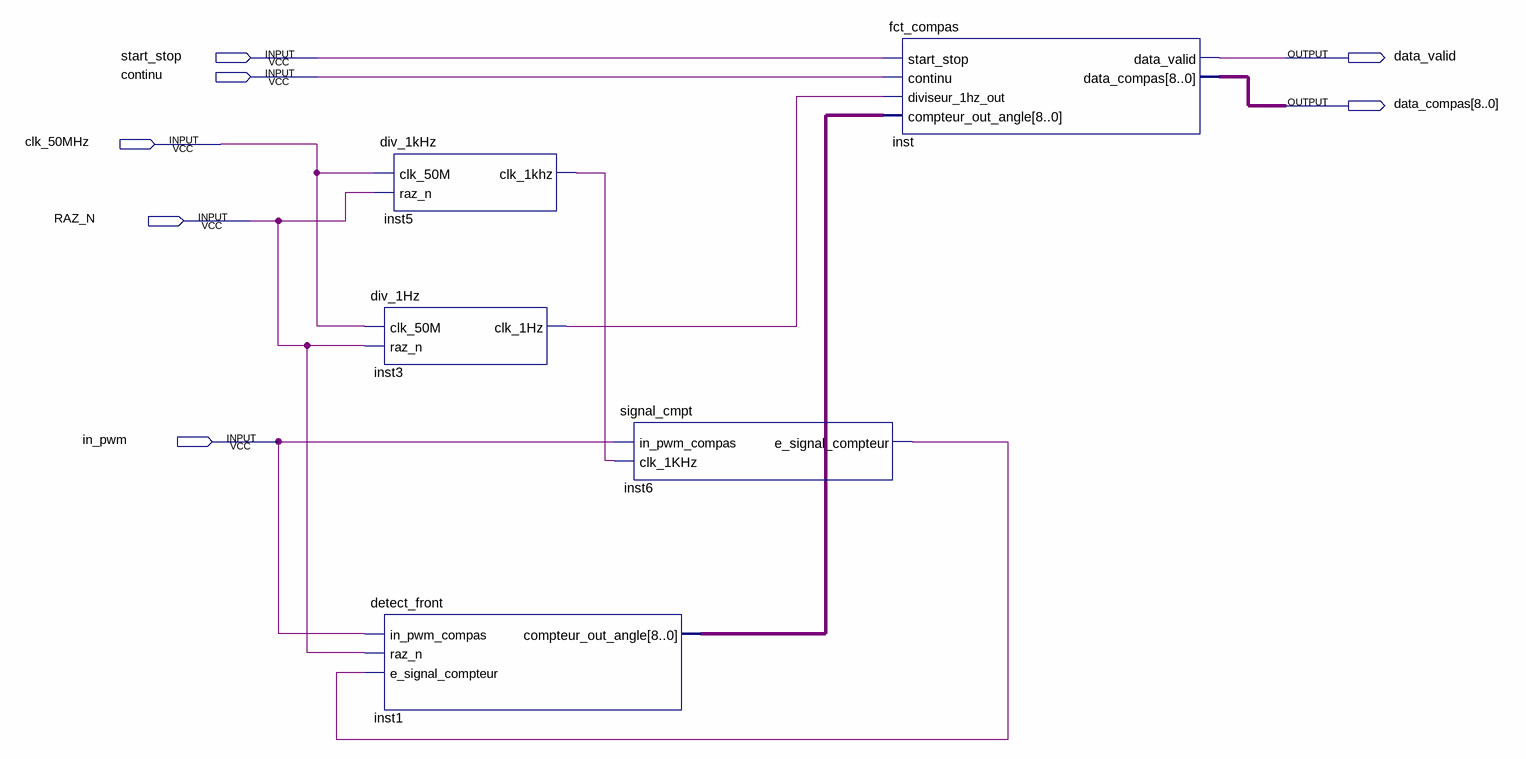
[diagram p0: schematic sheet]
// Quartus schematic traitement_compas.bdf as structural Verilog: 5 symbols, 7 pins
module traitement_compas (
  input  start_stop,
  input  continu,
  input  clk_50MHz,
  input  RAZ_N,
  input  in_pwm,
  output data_valid,
  output [8:0] data_compas
);

  wire inst3_clk_1hz, inst5_clk_1khz, inst6_e_signal_compteur;
  wire [8:0] inst1_compteur_out_angle;

  div_1Hz inst3 (.clk_50M(clk_50MHz), .raz_n(RAZ_N), .clk_1Hz(inst3_clk_1hz));
  detect_front inst1 (
    .in_pwm_compas(in_pwm), .raz_n(RAZ_N), .e_signal_compteur(inst6_e_signal_compteur),
    .compteur_out_angle(inst1_compteur_out_angle));
  div_1kHz inst5 (.clk_50M(clk_50MHz), .raz_n(RAZ_N), .clk_1khz(inst5_clk_1khz));
  signal_cmpt inst6 (.in_pwm_compas(in_pwm), .clk_1KHz(inst5_clk_1khz), .e_signal_compteur(inst6_e_signal_compteur));
  fct_compas inst (
    .start_stop(start_stop), .continu(continu), .diviseur_1hz_out(inst3_clk_1hz),
    .compteur_out_angle(inst1_compteur_out_angle), .data_valid(data_valid), .data_compas(data_compas));
endmodule
